# Altium schematic sheet Peripheral.SchDoc
size A
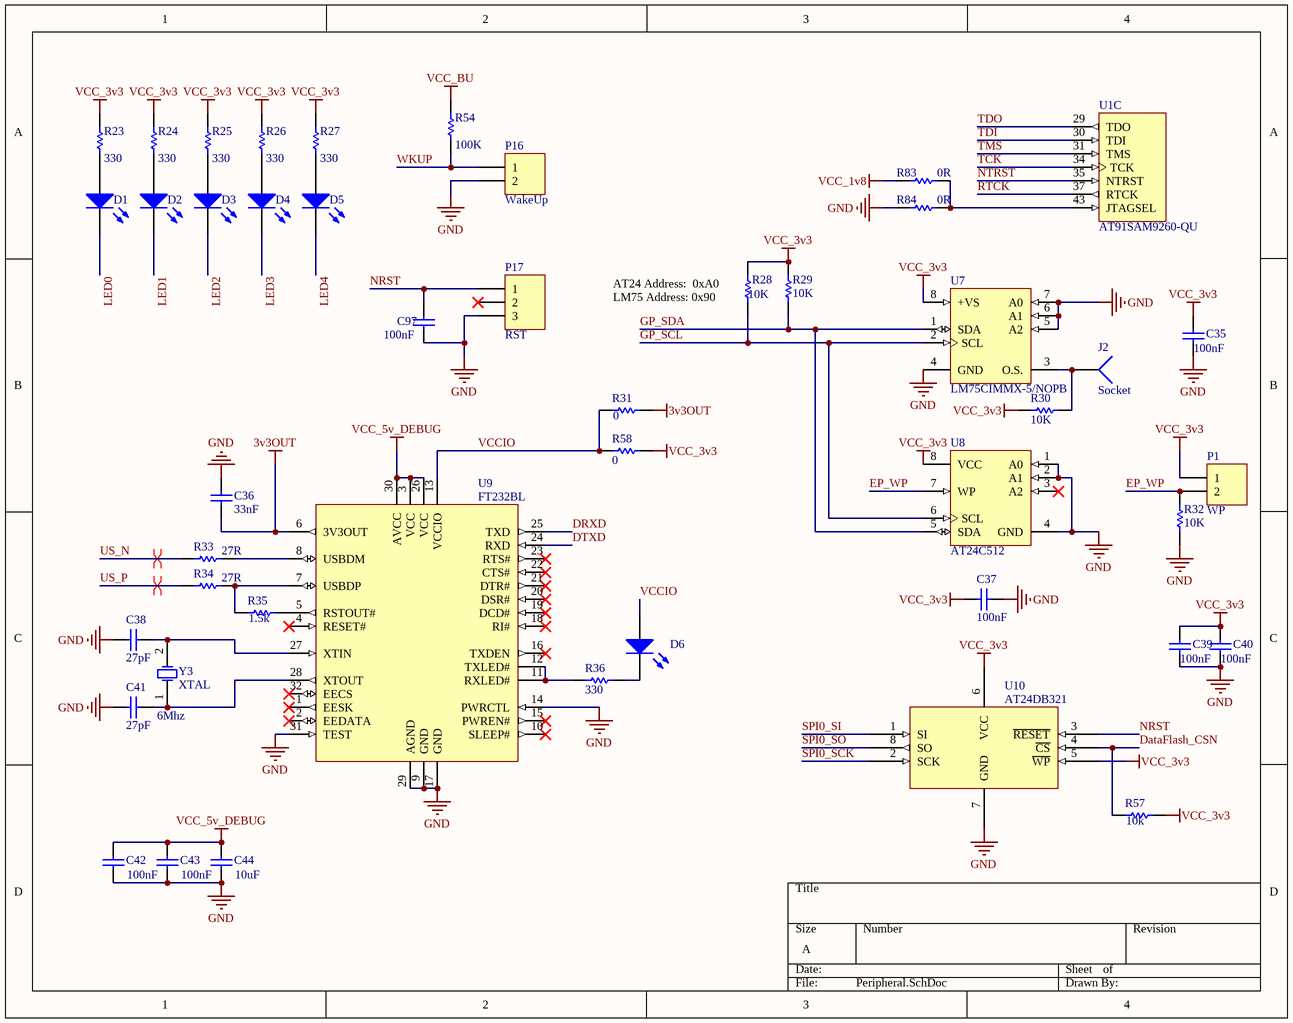
[diagram p0: Peripheral.SchDoc]

## Parts
C35  value 100nF  [C0805]  (hidden comment: Cap)
C36  value 33nF  [C0805]  (hidden comment: Cap)
C37  value 100nF  [C0805]  (hidden comment: Cap)
C38  value 27pF  [C0805]  (hidden comment: Cap)
C39  value 100nF  [C0805]  (hidden comment: Cap)
C40  value 100nF  [C0805]  (hidden comment: Cap)
C41  value 27pF  [C0805]  (hidden comment: Cap)
C42  value 100nF  [C0805]  (hidden comment: Cap)
C43  value 100nF  [C0805]  (hidden comment: Cap)
C44  value 10uF  [C0805]  (hidden comment: Cap)
C97  value 100nF  [C0805]  (hidden comment: Cap)
D1  LED0  [SMD_LED_1206]  (value not drawn)
D2  LED0  [SMD_LED_1206]  (value not drawn)
D3  LED0  [SMD_LED_1206]  (value not drawn)
D4  LED0  [SMD_LED_1206]  (value not drawn)
D5  LED0  [SMD_LED_1206]  (value not drawn)
D6  LED0  [SMD_LED_1206]  (value not drawn)
J2  Socket  [PIN1]
P1  WP  [HDR1X2]
P16  WakeUp  [HDR1X2]
P17  RST  [HDR1X3]
R23  value 330  [C0805]  (hidden comment: Res Semi)
R24  value 330  [C0805]  (hidden comment: Res Semi)
R25  value 330  [C0805]  (hidden comment: Res Semi)
R26  value 330  [C0805]  (hidden comment: Res Semi)
R27  value 330  [C0805]  (hidden comment: Res Semi)
R28  value 10K  [C0805]  (hidden comment: Res Semi)
R29  value 10K  [C0805]  (hidden comment: Res Semi)
R30  value 10K  [C0805]  (hidden comment: Res Semi)
R31  value 0  [C0805]  (hidden comment: Res Semi)
R32  value 10K  [C0805]  (hidden comment: Res Semi)
R33  value 27R  [C0805]  (hidden comment: Res Semi)
R34  value 27R  [C0805]  (hidden comment: Res Semi)
R35  value 1.5k  [C0805]  (hidden comment: Res Semi)
R36  value 330  [C0805]  (hidden comment: Res Semi)
R54  value 100K  [C0805]  (hidden comment: Res1)
R57  value 10k  [C0805]  (hidden comment: Res1)
R58  value 0  [C0805]  (hidden comment: Res Semi)
R83  value 0R  [0603PKG]  (hidden comment: Res Semi)
R84  value 0R  [0603PKG]  (hidden comment: Res Semi)
U1  AT91SAM9260-QU  [SQFP50P3122X3122X245-208N]  (part C of 4)
U7  LM75CIMMX-5/NOPB  [SSOP8]
U8  AT24C512  [SSOP8]
U9  FT232BL  [LQFP-32_N]
U10  AT24DB321  [SSOP8]
Y3  XTAL  value 6Mhz  [SMD_Crystal]

## Nets
3v3OUT: C36.2 R31.2 U9.6(3V3OUT)
GND: C35.1 C36.1 C37.1 C38.2 C39.1 C40.1 C41.2 C42.1 C43.1 C44.1 C97.1 P16.2 P17.3 R32.1 R84.2 U7.4(GND) U7.5(A2) U7.6(A1) U7.7(A0) U8.1(A0) U8.2(A1) U8.4(GND) U9.9(GND) U9.14(PWRCTL) U9.17(GND) U9.29(AGND) U9.31(TEST) U10.7(GND)
VCC_1v8: R83.2
VCC_3v3: C35.2 C37.2 C39.2 C40.2 P1.1 R23.2 R24.2 R25.2 R26.2 R27.2 R28.1 R29.1 R30.1 R57.1 R58.2 U7.8(+VS) U8.8(VCC) U10.5(~{WP}) U10.6(VCC)
VCC_5v_DEBUG: C42.2 C43.2 C44.2 U9.3(VCC) U9.26(VCC) U9.30(AVCC)
VCC_BU: R54.2
DataFlash_CSN: R57.2 U10.4(~{CS})
DRXD: U9.25(TXD)
DTXD: U9.24(RXD)
EP_WP: P1.2 R32.2 U8.7(WP)
GP_SCL: R28.2 U7.2(SCL) U8.6(SCL)
GP_SDA: R29.2 U7.1(SDA) U8.5(SDA)
LED0: D1.2(K)
LED1: D2.2(K)
LED2: D3.2(K)
LED3: D4.2(K)
LED4: D5.2(K)
NRST: C97.2 P17.1 U10.3(~{RESET})
NTRST: U1.35(NTRST)
RTCK: U1.37(RTCK)
SPI0_SCK: U10.2(SCK)
SPI0_SI: U10.1(SI)
SPI0_SO: U10.8(SO)
TCK: U1.34(TCK)
TDI: U1.30(TDI)
TDO: U1.29(TDO)
TMS: U1.31(TMS)
US_N: R33.2
US_P: R34.2
VCCIO: D6.1(A) R31.1 R58.1 U9.13(VCCIO)
WKUP: P16.1 R54.1
NetC38_1: C38.1 U9.27(XTIN) Y3.2(OSC2)
NetC41_1: C41.1 U9.28(XTOUT) Y3.1(OSC1)
NetD1_1: D1.1(A) R23.1
NetD2_1: D2.1(A) R24.1
NetD3_1: D3.1(A) R25.1
NetD4_1: D4.1(A) R26.1
NetD5_1: D5.1(A) R27.1
NetD6_2: D6.2(K) R36.1
NetJ2_1: J2.1 R30.2 U7.3(O.S.)
NetR33_1: R33.1 U9.8(USBDM)
NetR34_1: R34.1 R35.2 U9.7(USBDP)
NetR35_1: R35.1 U9.5(RSTOUT#)
NetR36_2: R36.2 U9.11(RXLED#) U9.12(TXLED#)
NetR83_1: R83.1 R84.1 U1.43(JTAGSEL)

Not connected (* = marked no-connect by the designer): P17 2*; U8 3(A2)*; U9 1(EESK)* 2(EEDATA)* 4(RESET#)* 10(SLEEP#)* 15(PWREN#)* 16(TXDEN)* 18(RI#)* 19(DCD#)* 20(DSR#)* 21(DTR#)* 22(CTS#)* 23(RTS#)* 32(EECS)*

## Layout directives
differential pair: US_N, US_P

## Notes on the sheet
- (near R28) AT24 Address:  0xA0
  LM75 Address: 0x90

## Library data of the parts
C35-C44 C97 = Cap: Capacitor; Published: 8-Jun-2000; LatestRevisionDate: 17-Jul-2002; LatestRevisionNote: Re-released for DXP Platform.; PackageReference: RAD-0.3; Publisher: Altium Limited; PackageDescription: Radial Cap, Thru-Hole; 2 Leads; 0.3 in Pin Spacing
D1-D6 = LED0: Typical INFRARED GaAs LED; Published: 8-Jun-2000; LatestRevisionDate: 08-Jul-2005; LatestRevisionNote: Mech Layer 1 removed.; PackageReference: LED-0; Publisher: Altium Limited; PackageDescription: LED; 2 Leads
P1 P16 = Header 2: Header, 2-Pin; LatestRevisionDate: 17-Jul-2002; LatestRevisionNote: Re-released for DXP Platform.; Publisher: Altium Limited
P17 = Header 3: Header, 3-Pin; LatestRevisionDate: 17-Jul-2002; LatestRevisionNote: Re-released for DXP Platform.; Publisher: Altium Limited
R23-R36 R58 R83 R84 = Res Semi: Semiconductor Resistor; Published: 8-Jun-2000; LatestRevisionDate: 17-Jul-2002; LatestRevisionNote: Re-released for DXP Platform.; PackageReference: AXIAL-0.5; Publisher: Altium Limited; PackageDescription: Axial Device, Thru-Hole; 2 Leads; 0.5 in Pin Spacing
R54 R57 = Res1: Resistor; Published: 8-Jun-2000; LatestRevisionDate: 17-Jul-2002; LatestRevisionNote: Re-released for DXP Platform.; PackageReference: AXIAL-0.3; Publisher: Altium Limited; PackageDescription: Axial Device, Thru-Hole; 2 Leads; 0.3 in Pin Spacing
U1 = AT91SAM9260-QU: AT91 ARM Thumb 32-bit Embedded MPU, 210MHz, 32KB ROM, 2x4KB SRAM, EBI, E-MAC, FS USB, 208-Pin PQFP, Industrial Grade (-40°C to 85°C), Pb-Free; DatasheetVersion: revJ, May-2011; PackageVersion: Jul-2005; PackageReference: QFP208; PackageDescription: 208-Pin Plastic Shrink Quad Flat Pack 0.5 mm Pitch; Code_JEDEC: MS-022; ComponentLink1Description: Manufacturer URL; ComponentLink1URL: http://www.atmel.com/; ComponentLink2Description: AT91SAM9260 Datasheet; ComponentLink2URL: http://www.atmel.com/dyn/resources/prod_documents/doc6221.pdf; ComponentLink3Description: AT91SAM9260 Summary; ComponentLink3URL: http://www.atmel.com/dyn/resources/prod_documents/6221s.pdf; ComponentLink4Description: ARM9E-S Reference Manual; ComponentLink4URL: http://www.atmel.com/dyn/resources/prod_documents/doc6178.pdf
U7 = LM75CIMMX-5/NOPB: Digital Temperature Sensor and Thermal Watchdog with Two-Wire Interface, 8 pin MINI SOIC; Manufacturer: National Semiconductor; PackageTopMarking: ZXTT*T00C; PowerWise: N; CompType: Temp Sensor IC; High-Reliability: Y; DatasheetVersion: Jul-2009; PackageVersion: revF, Apr-2008; PackageReference: MUA08A; PackageDescription: MINI SOIC, .118 x .118 x .034in, 8 Lead, .0256in Pitch; PartNumber: LM75CIMMX-5/NOPB; RoHS: Y; PinCount: 8; Code_JEDEC: MO-187-AA; ComponentLink1Description: Manufacturer URL; ComponentLink1URL: http://www.national.com/; ComponentLink2Description: LM75C Datasheet; ComponentLink2URL: http://www.national.com/ds/LM/LM75C.pdf; ComponentLink3Description: LM75C Web Page; ComponentLink3URL: http://www.national.com/pf/LM/LM75C.html; ComponentLink4Description: MUA08A Package Page; ComponentLink4URL: http://www.national.com/packaging/folders/mua08a.html
U8 = AT24C01BN-SP25-B: 1Kbit (128 x 8), 2-wire Bus Automotive Serial EEPROM with Write Protect, 2.5V, 8-Pin SOIC, Bulk; DatasheetVersion: 8517C,  Jan-2009; PackageVersion: revC, Mar-2005; PackageReference: 8S1; PackageDescription: 8-Lead (0.150" Wide Body), Plastic Gull Wing Small Outline (JEDEC SOIC); Code_JEDEC: MS-012-AA; Code_IPC: SOIC127P600-8; ComponentLink1Description: Manufacturer URL; ComponentLink1URL: http://www.atmel.com/; ComponentLink2Description: Datasheet; ComponentLink2URL: http://www.atmel.com/dyn/resources/prod_documents/doc8517.pdf
U9 = FT232BL: USB UART Asynchronous Serial Data Transfer Chip, 0 to +70 degC, 32-pin LQFP, Pb-Free; Manufacturer: FTDI; DatasheetVersion: ver 2.2, Nov-2011; PackageVersion: Nov-11; PackageReference: LQFP-32; PackageDescription: 32-Pin Thin Quad Flat Pack, 7 x 7 mm Body, 0.8 mm Pitch; PartNumber: FT232BL; ComponentLink1Description: Manufacturer URL; ComponentLink1URL: http://www.ftdichip.com/; ComponentLink2Description: Datasheet; ComponentLink2URL: http://www.ftdichip.com/Support/Documents/DataSheets/ICs/DS_FT232BL_BQ.pdf
U10 = AT24D321: Atmel serial flash
Y3 = XTAL: Crystal Oscillator; Published: 8-Jun-2000; LatestRevisionDate: 17-Jul-2002; LatestRevisionNote: Re-released for DXP Platform.; PackageReference: R38; Publisher: Altium Limited; PackageDescription: Crystal, Thru-Hole; 2 Leads; Body 3.1 x 8.2 mm (Dia.xH)
J2 = Socket: LatestRevisionDate: 17-Jul-2002; LatestRevisionNote: Re-released for DXP Platform.; Publisher: Altium Limited